# EAGLE design Gadget-Box (EAGLE 6.6.0)

## Sheet 1 of 3
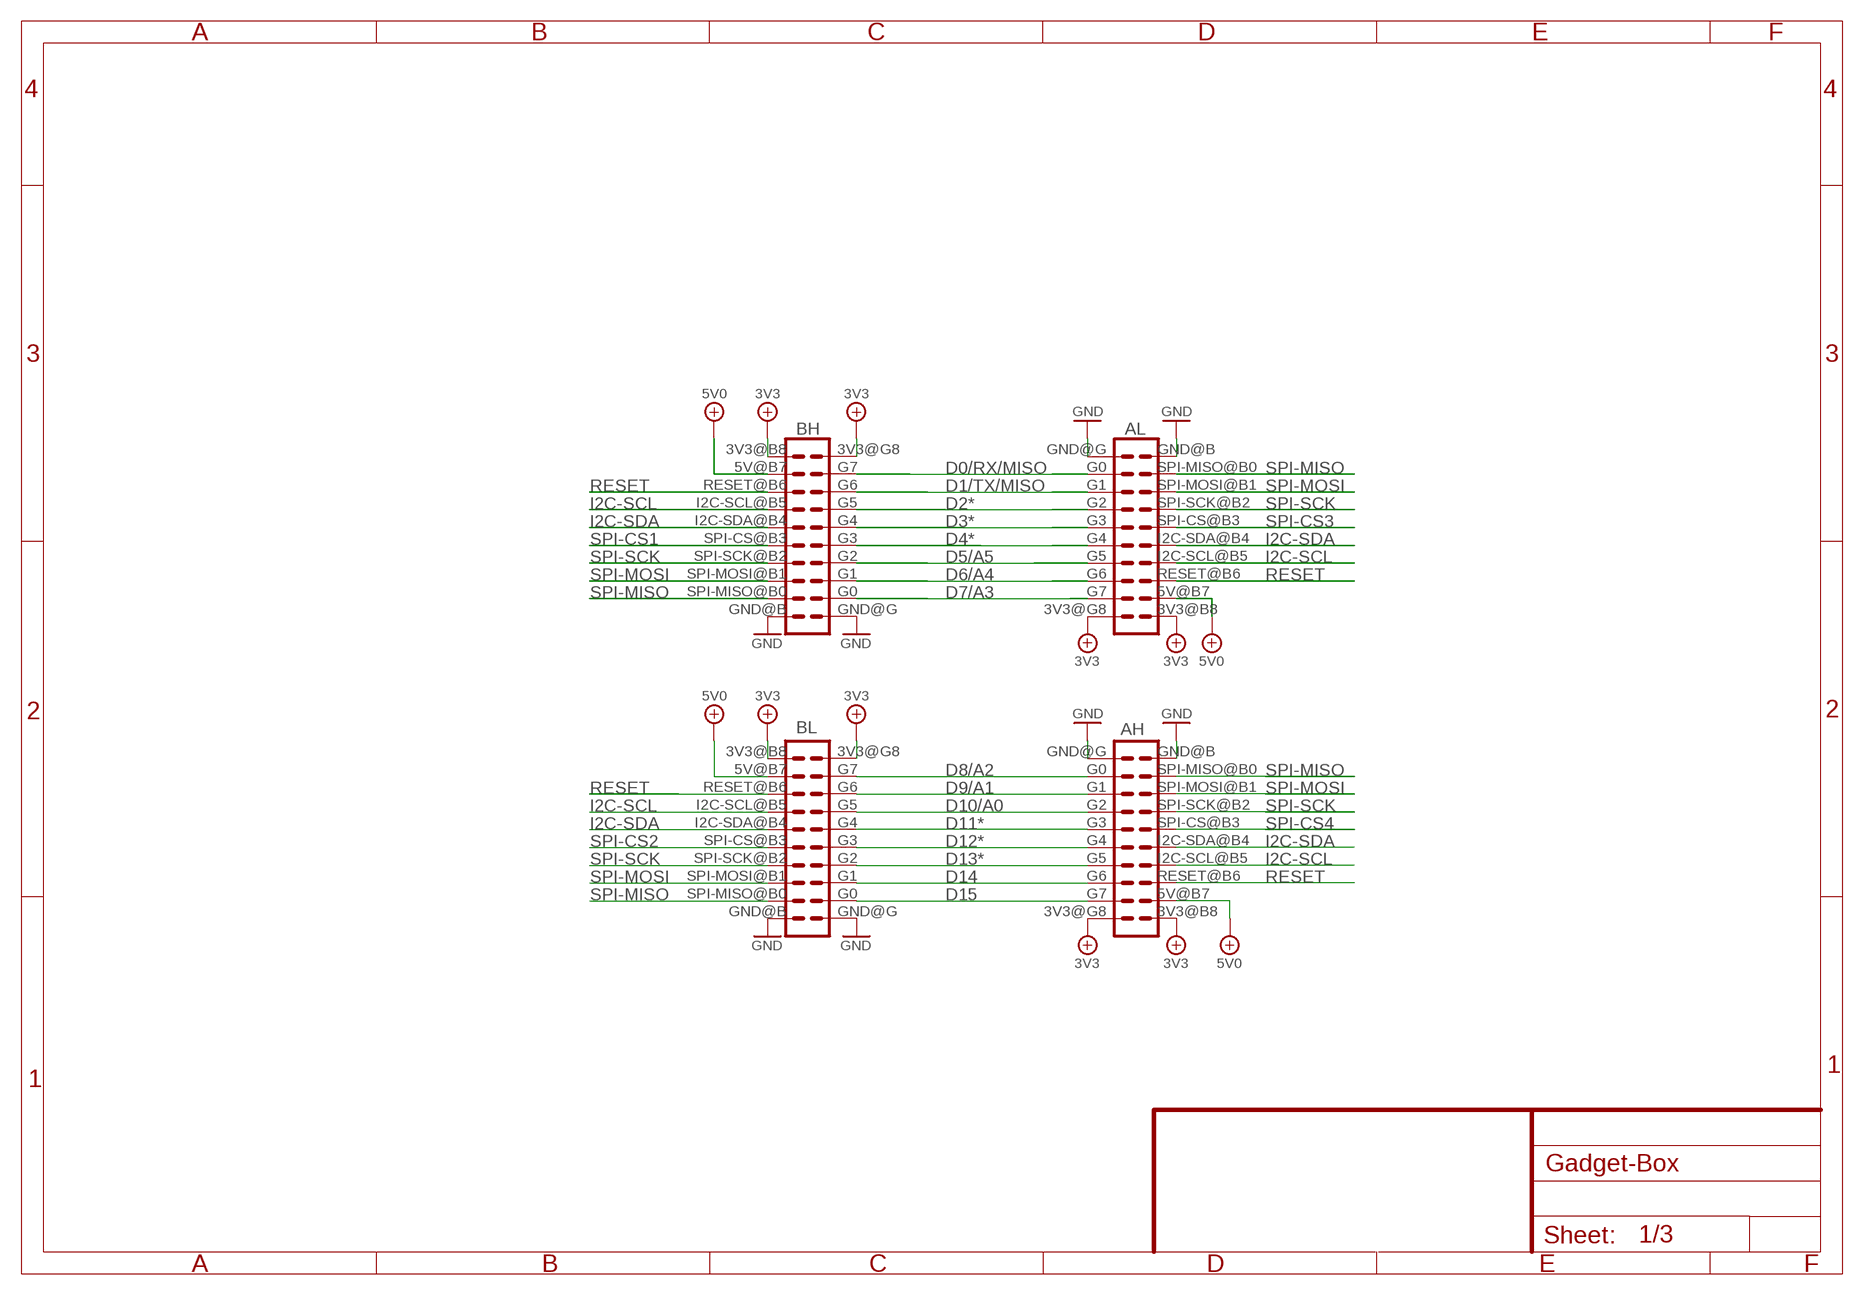
[diagram p0: schematic, sheet 1]

### Parts
AH  ECOGECOG_SLOT  [ECOG]
AL  ECOGECOG_SLOT  [ECOG]
BH  ECOGECOG_SLOT  [ECOG]
BL  ECOGECOG_SLOT  [ECOG]

### Nets
3V3: AH.3V3@B8(3V3) AH.3V3@G8(3V3) AL.3V3@B8(3V3) AL.3V3@G8(3V3) BH.3V3@B8(3V3) BH.3V3@G8(3V3) BL.3V3@B8(3V3) BL.3V3@G8(3V3) ; also sheet 2,3
D0/RX/MISO: AL.G0 BH.G7 ; also sheet 2
D1/TX/MISO: AL.G1 BH.G6 ; also sheet 2
D2*: AL.G2 BH.G5 ; also sheet 2
D3*: AL.G3 BH.G4 ; also sheet 2
D4*: AL.G4 BH.G3 ; also sheet 2
D5/A5: AL.G5 BH.G2 ; also sheet 2,3
D6/A4: AL.G6 BH.G1 ; also sheet 2
D7/A3: AL.G7 BH.G0 ; also sheet 2
D8/A2: AH.G0 BL.G7 ; also sheet 2
D9/A1: AH.G1 BL.G6 ; also sheet 2
D10/A0: AH.G2 BL.G5 ; also sheet 2
D11*: AH.G3 BL.G4 ; also sheet 2
D12*: AH.G4 BL.G3 ; also sheet 2
D13*: AH.G5 BL.G2 ; also sheet 2
D14: AH.G6 BL.G1 ; also sheet 2
D15: AH.G7 BL.G0 ; also sheet 2
GND [gnd]: AH.GND@B(GND) AH.GND@G(GND) AL.GND@B(GND) AL.GND@G(GND) BH.GND@B(GND) BH.GND@G(GND) BL.GND@B(GND) BL.GND@G(GND) ; also sheet 2,3
I2C-SCL: AH.I2C-SCL@B5(I2C-SCL) AL.I2C-SCL@B5(I2C-SCL) BH.I2C-SCL@B5(I2C-SCL) BL.I2C-SCL@B5(I2C-SCL) ; also sheet 2
I2C-SDA: AH.I2C-SDA@B4(I2C-SDA) AL.I2C-SDA@B4(I2C-SDA) BH.I2C-SDA@B4(I2C-SDA) BL.I2C-SDA@B4(I2C-SDA) ; also sheet 2
RESET: AH.RESET@B6(RESET) AL.RESET@B6(RESET) BH.RESET@B6(RESET) BL.RESET@B6(RESET) ; also sheet 2
SPI-CS1: BH.SPI-CS@B3(SPI-CS) ; also sheet 2
SPI-CS2: BL.SPI-CS@B3(SPI-CS) ; also sheet 2
SPI-CS3: AL.SPI-CS@B3(SPI-CS) ; also sheet 2
SPI-CS4: AH.SPI-CS@B3(SPI-CS) ; also sheet 2
SPI-MISO: AH.SPI-MISO@B0(SPI-MISO) AL.SPI-MISO@B0(SPI-MISO) BH.SPI-MISO@B0(SPI-MISO) BL.SPI-MISO@B0(SPI-MISO) ; also sheet 2
SPI-MOSI: AH.SPI-MOSI@B1(SPI-MOSI) AL.SPI-MOSI@B1(SPI-MOSI) BH.SPI-MOSI@B1(SPI-MOSI) BL.SPI-MOSI@B1(SPI-MOSI) ; also sheet 2
SPI-SCK: AH.SPI-SCK@B2(SPI-SCK) AL.SPI-SCK@B2(SPI-SCK) BH.SPI-SCK@B2(SPI-SCK) BL.SPI-SCK@B2(SPI-SCK) ; also sheet 2
VBUS: AH.5V@B7(5V) AL.5V@B7(5V) BH.5V@B7(5V) BL.5V@B7(5V) ; supply symbol labelled 5V0 ; also sheet 2,3

## Sheet 2 of 3
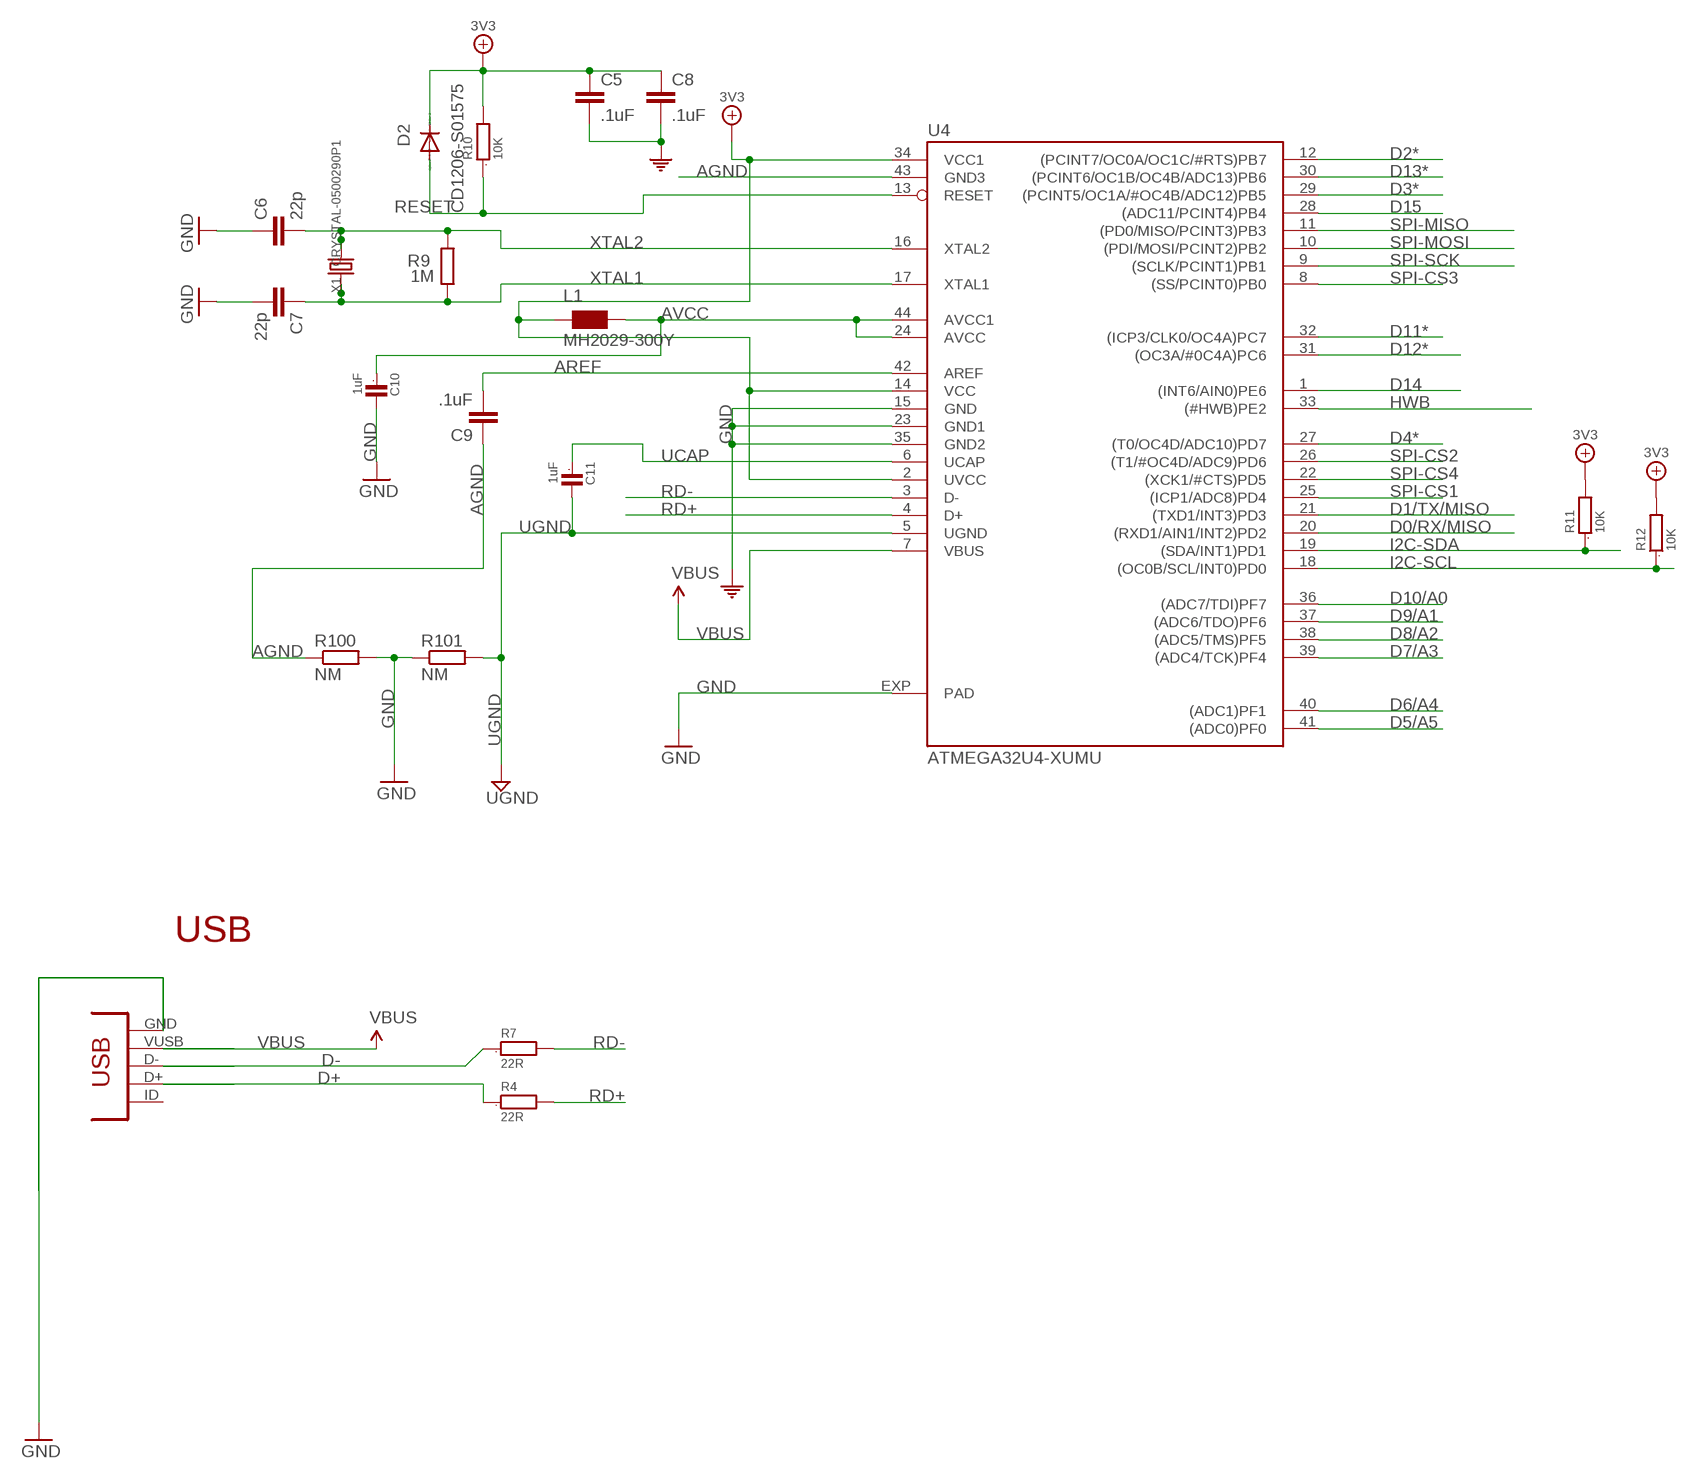
[diagram p1: schematic, sheet 2, part 1 of 2]
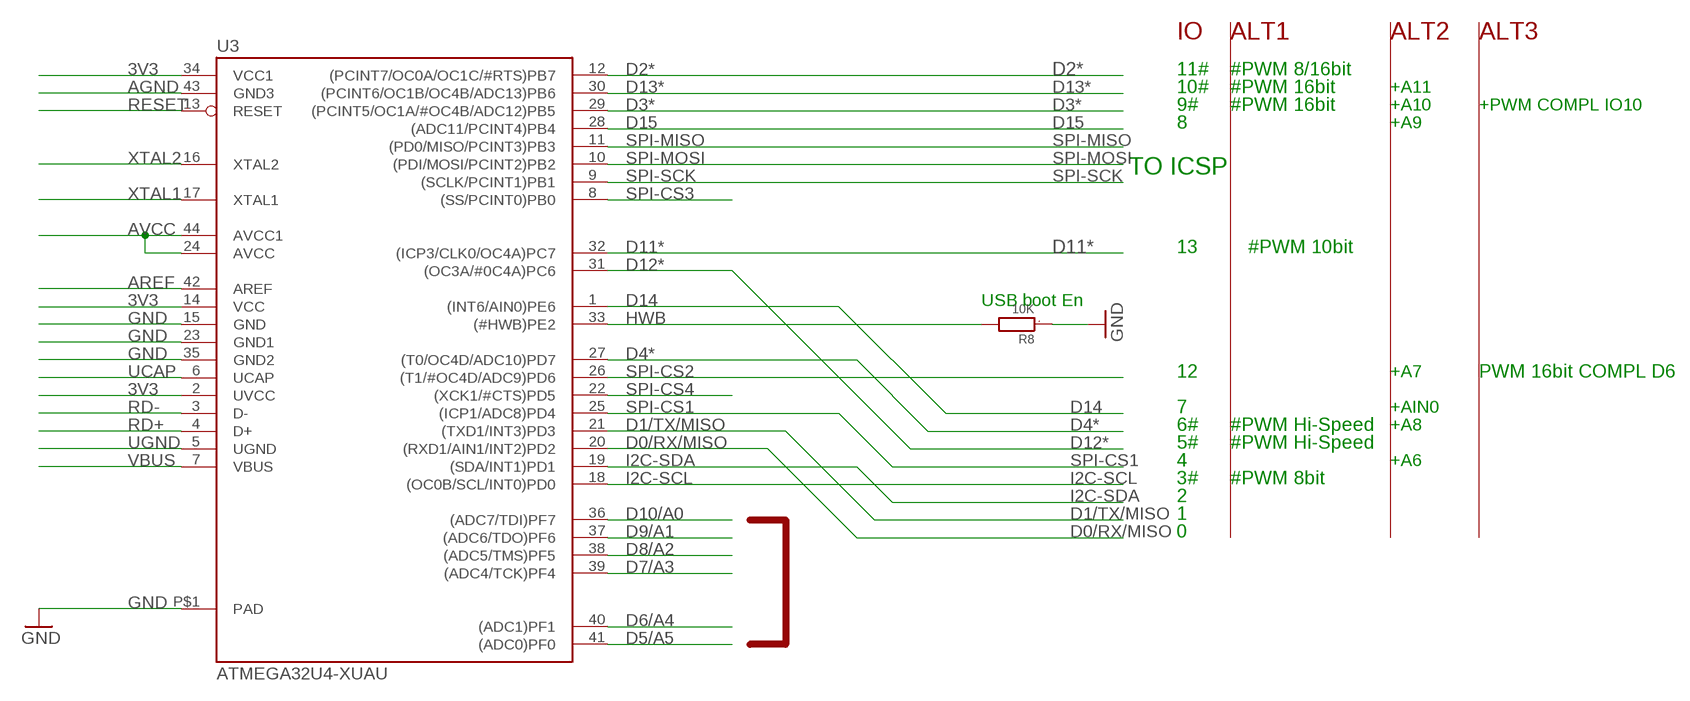
[diagram p2: schematic, sheet 2, part 2 of 2]

### Parts
C5  .1uF  C-EUC0603  [C0603-ROUND]
C6  22p  C-EUC0603  [C0603-ROUND]
C7  22p  C-EUC0603  [C0603-ROUND]
C8  .1uF  C-EUC0603  [C0603-ROUND]
C9  .1uF  C-EUC0603  [C0603-ROUND]
C10  1uF  C0603  [0603]
C11  1uF  C0603  [0603]
D2  CD1206-S01575  DIODE-MINIMELF  [MINIMELF]
L1  MH2029-300Y  WE-CBF_0805  [0805]
R4  22R  R0805  [0805]
R7  22R  R0805  [0805]
R8  10K  R0603  [0603]
R9  1M  R-EU_R0603  [R0603-ROUND]
R10  10K  R0603  [0603]
R11  10K  R0603  [0603]
R12  10K  R0603  [0603]
R100  NM  R-EU_R0603  [R0603-ROUND]
R101  NM  R-EU_R0603  [R0603-ROUND]
U3  ATMEGA32U4-XUAU  [TQFP44-PAD]
U4  ATMEGA32U4-XUMU  [QFN44ML7X7]
USB  CONN_USB  [CONN_USB_MINI-B]
X1  CRYSTAL-0500290P1  [2P-SMD-5.0X3.2]

### Nets
3V3: C5.1 C8.1 D2.C L1.1 R10.2 R11.2 R12.2 U3.2(UVCC) U3.14(VCC) U3.34(VCC1) U4.2(UVCC) U4.14(VCC) U4.34(VCC1) ; also sheet 1,3
AGND: C9.1 R100.1 U3.43(GND3) U4.43(GND3)
AREF [aref]: C9.2 U3.42(AREF) U4.42(AREF)
AVCC: C10.1 L1.2 U3.24(AVCC) U3.44(AVCC1) U4.24(AVCC) U4.44(AVCC1)
D0/RX/MISO: U3.20((RXD1/AIN1/INT2)PD2) U4.20((RXD1/AIN1/INT2)PD2) ; also sheet 1
D1/TX/MISO: U3.21((TXD1/INT3)PD3) U4.21((TXD1/INT3)PD3) ; also sheet 1
D2*: U3.12((PCINT7/OC0A/OC1C/#RTS)PB7) U4.12((PCINT7/OC0A/OC1C/#RTS)PB7) ; also sheet 1
D3*: U3.29((PCINT5/OC1A/#OC4B/ADC12)PB5) U4.29((PCINT5/OC1A/#OC4B/ADC12)PB5) ; also sheet 1
D4*: U3.27((T0/OC4D/ADC10)PD7) U4.27((T0/OC4D/ADC10)PD7) ; also sheet 1
D5/A5: U3.41((ADC0)PF0) U4.41((ADC0)PF0) ; also sheet 1,3
D6/A4: U3.40((ADC1)PF1) U4.40((ADC1)PF1) ; also sheet 1
D7/A3: U3.39((ADC4/TCK)PF4) U4.39((ADC4/TCK)PF4) ; also sheet 1
D8/A2: U3.38((ADC5/TMS)PF5) U4.38((ADC5/TMS)PF5) ; also sheet 1
D9/A1: U3.37((ADC6/TDO)PF6) U4.37((ADC6/TDO)PF6) ; also sheet 1
D10/A0: U3.36((ADC7/TDI)PF7) U4.36((ADC7/TDI)PF7) ; also sheet 1
D11*: U3.32((ICP3/CLK0/OC4A)PC7) U4.32((ICP3/CLK0/OC4A)PC7) ; also sheet 1
D12*: U3.31((OC3A/#0C4A)PC6) U4.31((OC3A/#0C4A)PC6) ; also sheet 1
D13*: U3.30((PCINT6/OC1B/OC4B/ADC13)PB6) U4.30((PCINT6/OC1B/OC4B/ADC13)PB6) ; also sheet 1
D14: U3.1((INT6/AIN0)PE6) U4.1((INT6/AIN0)PE6) ; also sheet 1
D15: U3.28((ADC11/PCINT4)PB4) U4.28((ADC11/PCINT4)PB4) ; also sheet 1
D+: R4.1 USB.D+
D-: R7.1 USB.D-
GND [gnd]: C5.2 C6.1 C7.2 C8.2 C10.2 R8.1 R100.2 R101.1 U3.15(GND) U3.23(GND1) U3.35(GND2) U3.P$1(PAD) U4.15(GND) U4.23(GND1) U4.35(GND2) U4.EXP(PAD) USB.GND ; supply symbol labelled COM ; also sheet 1,3
HWB: R8.2 U3.33((#HWB)PE2) U4.33((#HWB)PE2)
I2C-SCL: R12.1 U3.18((OC0B/SCL/INT0)PD0) U4.18((OC0B/SCL/INT0)PD0) ; also sheet 1
I2C-SDA: R11.1 U3.19((SDA/INT1)PD1) U4.19((SDA/INT1)PD1) ; also sheet 1
RD+: R4.2 U3.4(D+) U4.4(D+)
RD-: R7.2 U3.3(D-) U4.3(D-)
RESET: D2.A R10.1 U3.13(RESET) U4.13(RESET) ; also sheet 1
SPI-CS1: U3.25((ICP1/ADC8)PD4) U4.25((ICP1/ADC8)PD4) ; also sheet 1
SPI-CS2: U3.26((T1/#OC4D/ADC9)PD6) U4.26((T1/#OC4D/ADC9)PD6) ; also sheet 1
SPI-CS3: U3.8((SS/PCINT0)PB0) U4.8((SS/PCINT0)PB0) ; also sheet 1
SPI-CS4: U3.22((XCK1/#CTS)PD5) U4.22((XCK1/#CTS)PD5) ; also sheet 1
SPI-MISO: U3.11((PD0/MISO/PCINT3)PB3) U4.11((PD0/MISO/PCINT3)PB3) ; also sheet 1
SPI-MOSI: U3.10((PDI/MOSI/PCINT2)PB2) U4.10((PDI/MOSI/PCINT2)PB2) ; also sheet 1
SPI-SCK: U3.9((SCLK/PCINT1)PB1) U4.9((SCLK/PCINT1)PB1) ; also sheet 1
UCAP: C11.1 U3.6(UCAP) U4.6(UCAP)
UGND [gnd]: C11.2 R101.2 U3.5(UGND) U4.5(UGND)
VBUS: U3.7(VBUS) U4.7(VBUS) USB.VUSB ; also sheet 1,3
XTAL1: C7.1 R9.1 U3.17(XTAL1) U4.17(XTAL1) X1.1
XTAL2: C6.2 R9.2 U3.16(XTAL2) U4.16(XTAL2) X1.2
Unconnected: USB.BODY@1(BODY) USB.BODY@2(BODY) USB.BODY@3(BODY) USB.BODY@4(BODY) USB.ID(USBID)

### Notes on the sheet
- IO | ALT1 | ALT2 | ALT3
- 11# | #PWM 8/16bit
- 10# | #PWM 16bit | +A11
- 9# | #PWM 16bit | +A10 | +PWM COMPL IO10
- 8 | +A9
- TO ICSP
- 13 | #PWM 10bit
- USB boot En
- 12 | +A7 | PWM 16bit COMPL D6
- 7 | +AIN0
- 6# | #PWM Hi-Speed | +A8
- 5# | #PWM Hi-Speed
- 4 | +A6
- 3# | #PWM 8bit
- 2
- 1
- 0
- USB

## Sheet 3 of 3
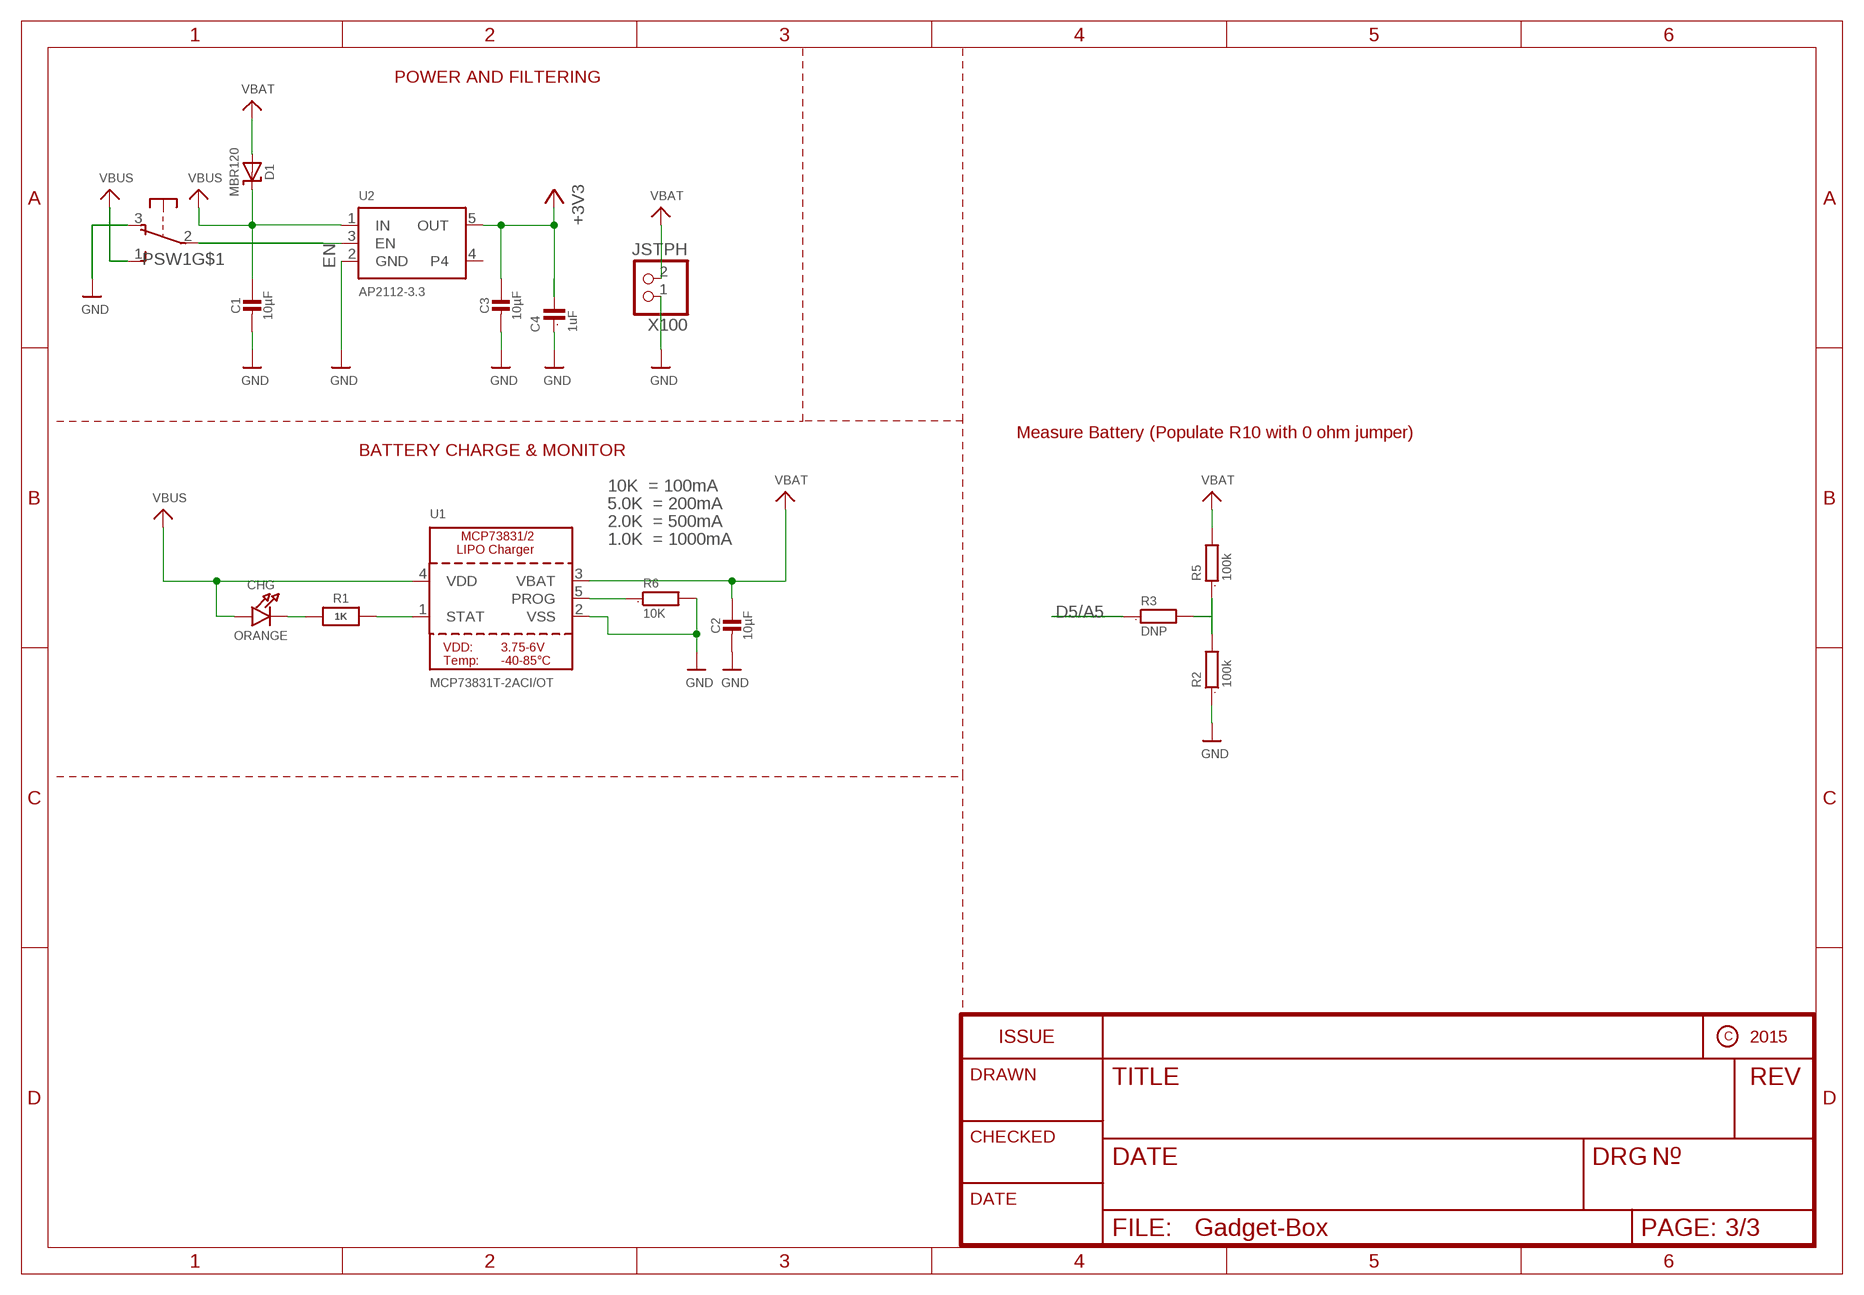
[diagram p3: schematic, sheet 3]

### Parts
C1  10µF  CAP_CERAMIC0805-NOOUTLINE  [0805-NO]
C2  10µF  CAP_CERAMIC0805-NOOUTLINE  [0805-NO]
C3  10µF  CAP_CERAMIC0805-NOOUTLINE  [0805-NO]
C4  1uF  C0603  [0603]
CHG  ORANGE  LED0805_NOOUTLINE  [CHIPLED_0805_NOOUTLINE]
D1  MBR120  DIODE-SCHOTTKYSOD-123  [SOD-123]
PSW1  OS102011MA1Q  [OS102011MA1Q]
R1  1K  RESISTOR_0603_NOOUT  [0603-NO]
R2  100k  R0603  [0603]
R3  DNP  R0603  [0603]
R5  100k  R0603  [0603]
R6  10K  R0603  [0603]
U1  MCP73831T-2ACI/OT  MCP73831/2  [SOT23-5]
U2  AP2112-3.3  VREG_SOT23-5  [SOT23-5]
X100  JSTPH  CON_JST_PH_2PIN  [JSTPH2]

### Nets
3V3: C3.1 C4.2 U2.5(OUT) ; supply symbol labelled +3V3 ; also sheet 1,2
D5/A5: R3.1 ; also sheet 1,2
EN: PSW1.2(P) U2.3(EN)
GND [gnd]: C1.2 C2.2 C3.2 C4.1 PSW1.3(O) R2.1 R6.2 U1.2(VSS) U2.2(GND) X100.1 ; also sheet 1,2
N$1: CHG.C R1.1
N$2: R2.2 R3.2 R5.1
N$3: R1.2 U1.1(STAT)
N$4: R6.1 U1.5(PROG)
VBAT: C2.1 D1.A R5.2 U1.3(VBAT) X100.2
VBUS: C1.1 CHG.A D1.C PSW1.1(S) U1.4(VDD) U2.1(IN) ; also sheet 1,2
Unconnected: PSW1.MT1(MT) PSW1.MT2(MT) U2.4

### Notes on the sheet
- POWER AND FILTERING
- Measure Battery (Populate R10 with 0 ohm jumper)
- BATTERY CHARGE & MONITOR
- 10K  = 100mA
- 5.0K  = 200mA
- 2.0K  = 500mA
- 1.0K  = 1000mA

## Library data of the parts
AH AL BH BL = eCogs:ECOG; PARTNO: PPPC102LFBN-RC,SULLINS CONNECTOR SOLUTIONS,dk,S6106-ND,"CONN HEADER FEM 20POS.1"" DL GOLD", REF67
C1-C3 = microbuilder:CAP_CERAMIC: Ceramic Capacitors For new designs, use the packages preceded by an '_' character since they are more reliable: The following footprints should be used on most boards: _0402 - Standard footprint for regular board layouts _0603 - Standard footprint for regular board layouts _0805 - Standard footprint for regular board layouts _1206 - Standard footprint for regular board layouts For extremely tight-pitch boards where space is at a premium, the following 'micro-pitch' footprints can be used (smaller pads, no silkscreen outline, etc.): _0402MP - Micro-pitch footprint for very dense/compact boards _0603MP - Micro-pitch footprint for very dense/compact boards _0805MP - Micro-pitch footprint for very dense/compact boards _1206MP - Micro-pitch footprint for very dense/compact boards; PARTNO: CL21F106ZPFNNNE,Samsung,DK,1276-3012-1-ND,CAP CER 10UF 10V Y5V 0805, REF1
C4 C10 C11 = GadgetFactory:C: CAPACITOR, European symbol; PARTNO: C1608X5R1A105K080AC,TDK CORPORATION (VA),dk,445-1321-1-ND,CAP CER 1UF 10V X5R 0603, REF53
C5 C8 C9 = SmartPrj:C-EU: CAPACITOR, European symbol; PARTNO: GRM188F51E104ZA01D,MURATA ELECTRONICS (VA),DK,490-1575-1-ND,CAP CER .1UF 25V Y5V 0603, REF2
C6 C7 = SmartPrj:C-EU: CAPACITOR, European symbol; PARTNO: C1608C0G1H220J080AA,TDK CORPORATION (VA),dk,445-1273-1-ND,CAP CER 22PF 50V C0G 0603, REF58
CHG = microbuilder:LED: LED 0603 - 0603 Surface Mount Package 2mA: Green LED - Low Power (3.9mcd, 2ma, 1.7Vf) - Digikey: 475-2709-2-ND Orange LED - Low Power (9.8mcd, 2ma, 1.8Vf) - Digikey: 475-1194-2-ND Red LED - Low Power (5mcd, 2ma, 1.8Vf) - Digikey: 475-1195-2-ND Yellow LED - Low Power (7mcd, 2ma, 1.8Vf) - Digikey: 475-1196-2-ND 5mA: Blue LED - Low Power (17mcd, 5ma, 2.9Vf) - Digikey: LNJ937W8CRACT-ND 0805 - 0805 Surface Mount Package 2mA: Red LED (8.8mcd, 2mA, 1.8Vf, Clear) - Low Power [Digikey: 475-2510-1-ND] Green LED (5mcd, 2mA, 1.8Vf, Clear) - Low Power [Digikey: 475-2730-1-ND] Yellow LED (11.3mcd, 2mA, 1.8Vf, Clear) - Low Power [Digikey: 475-2555-1-ND] 20mA: Red LED (104mcd, 20mA, Diffused) - LS R976 [Digikey: 475-1278-6-ND] Red LED (12mcd, 20mA, 2.0Vf, Clear) - APT2012EC [Digikey: 754-1128-1-ND] Green LED (15mcd, 20mA, 2.2Vf, Clear) - APT2012GC [Digikey: 754-1131-1-ND] Orange LED (160mcd, 20mA, 2.1Vf, Clear) - APT2012SECK [Digikey: 754-1130-1-ND] 1206 - 1206 Surface Mount Package Green LED (26mcd, 20mA, Diffused) - LG N971 [Digikey: 475-1407-6-ND] Red LED (15mcd, 20mA, Diffused) - LH N974 [Digikey: 475-1416-6-ND] Cree - Cree High-Power Surface Mount LEDs XPEBWT-L1-0000-00D50 - White 111lm 350mA 2.9Vf 6200K 110° XTEAWT-00-0000-00000LEE3 - White 114lm 350mA 2.85Vf 5000K 115° Everlight - Everlight 45-21 Series Surface Mount LEDs 45-21/QK2C-B2832AC2CB2/2T - Warm White 2000mcd 20mA 3.25Vf 3050K 120° 45-21/LK2C-B38452C4CB2/2T - Nuetral White 2000mcd 20mA 3.25Vf 4150K 120° 45-21/LK2C-B50634C6CB2/2T - Cold White 2200mcd 20mA 3.25Vf 5650K 120° PLCC2 Reverse Mount LS T77K-J1L2-1-0-2-R18-Z - Red 11.25mcd 2mA 1.8Vf 630nm 120° LO T77K-L1M2-24-Z - Orange 19.6mcd 2mA 1.8Vf 606nm 120° LY T77K-K2M1-26-Z - Yellow 15.7mcd 2mA 1.8Vf 587nm 120°; PARTNO: LTST-C171EKT,LITE-ON INC (VA),DK,160-1422-1-ND,LED RED ORAN CLEAR THIN 0805 SMD, REF6
D1 = microbuilder:DIODE-SCHOTTKY; PARTNO: MBR120VLSFT3G,on semiconductor,dk,MBR120VLSFT3GOSCT-ND ,DIODE SCHOTTKY 20V 1A SOD123FL , REF71
D2 = diode:DIODE-: DIODE; PARTNO: CD1206-S01575,BOURNS INC (VA),dk,CD1206-S01575CT-ND,DIODE GEN PURP 100V 150MA 1206, REF46
L1 = wuerth-elektronik:WE-CBF: SMD EMI Suppression Ferrite Beads - excellent anti-EMI properties - low DCR - impedances till 3000 ohms - rated current up to 6 A; PARTNO: MH2029-300Y,BOURNS INC (VA),dk,MH2029-300YCT-ND,FERRITE BEAD 30 OHM 0805 1LN, REF60
PSW1 = adafruit:OS102011MA1Q: OS10201MA1Q through-hole right angle switch http://www.ladyada.net/library/eagle; PARTNO: OS102011MA1QN1,C&K Components,dk,CKN9559-ND,SWITCH SLIDE SPDT 100MA 12V , REF72
R1 = microbuilder:RESISTOR: Resistors For new designs, use the packages preceded by an '_' character since they are more reliable: The following footprints should be used on most boards: _0402 - Standard footprint for regular board layouts _0603 - Standard footprint for regular board layouts _0805 - Standard footprint for regular board layouts _1206 - Standard footprint for regular board layouts For extremely tight-pitch boards where space is at a premium, the following 'micro-pitch' footprints can be used (smaller pads, no silkscreen outline, etc.): _0402MP - Micro-pitch footprint for very dense/compact boards _0603MP - Micro-pitch footprint for very dense/compact boards _0805MP - Micro-pitch footprint for very dense/compact boards _1206MP - Micro-pitch footprint for very dense/compact boards; PARTNO: RC0603JR-071KL,YAGEO (VA),dk,311-1.0KGRTR-ND,RES SMD 1K OHM 5% 1/10W 0603 , REF73
R2 R5 = GadgetFactory:R: RESISTOR, European symbol; PARTNO: RC0603JR-07100KL,YAGEO (VA),dk,311-100KGRCT-ND,RES SMD 100K OHM 5% 1/10W 0603 , REF76
R3 = GadgetFactory:R: RESISTOR, European symbol; BOM: EXCLUDE
R4 R7 = GadgetFactory_6.0:R: RESISTOR, European symbol; PARTNO: RMCF0805JT22R0,STACKPOLE ELECTRONICS INC (VA),dk,RMCF0805JT22R0CT-ND,RES SMD 22 OHM 5% 1/8W 0805, REF62
R6 R11 R12 = GadgetFactory:R: RESISTOR, European symbol; PARTNO: RC0603JR-0710KL,YAGEO (VA),dk,311-10KGRCT-ND,RES SMD 10K OHM 5% 1/10W 0603 , REF36
R8 R10 = GadgetFactory_6.0:R: RESISTOR, European symbol; PARTNO: RC0603JR-0710KL,YAGEO (VA),dk,311-10KGRCT-ND,RES SMD 10K OHM 5% 1/10W 0603 , REF36
R9 = SmartPrj:R-EU_: RESISTOR, European symbol; PARTNO: RMCF0603JT1M00,STACKPOLE ELECTRONICS INC (VA),dk,RMCF0603JT1M00CT-ND,RES SMD 1M OHM 5% 1/10W 0603, REF57
R100 R101 = SmartPrj:R-EU_: RESISTOR, European symbol; BOM: EXCLUDE
U1 = microbuilder:MCP73831/2: MCP73831/2 LIPO Charger VDD: 3.75 - 6V Temp -40 - 85°C Programmable Charge Rate: 15-500mA NOTE: STAT is a tri-state logic output on the MCP73831 and an open-drain output on the MCP73832. SOT23-5 with 4.2V output and tri-state logic on STAT = MCP73831T-2ACI/OT; PARTNO: MCP73831T-2ACI/OT,MICROCHIP TECHNOLOGY (VA),dk,MCP73831T-2ACI/OTCT-ND,IC CONTROLLR LI-ION 4.2V SOT23-5, REF74
U2 = microbuilder:VREG_SOT23-5: SOT23-5 Fixed Voltage Regulators Part Current Out V Out V In V Dropout θJA (°C/W) TJ (°C) Digikey Part No. ADP121 150mA 3.3V 3.4-5.5V 0.09V @ 150mA -- -- ADP121-AUJZ33R7CT-ND ADP121 150mA 3.0V 3.1-5.5V 0.09V @ 150mA -- -- ADP121-AUJZ30R7CT-ND ADP122 300mA 3.3V 3.4-5.5V 0.085V @ 300mA -- -- ADP122AUJZ-3.3-R7CT-ND ADP1712 300mA 3.3V 3.5-5.5V 0.17V @ 300mA -- -- ADP1712AUJZ-3.3-R7TR-ND AP7311 (Low Cost) 150mA 3.3V 3.5-6V 0.15V @ 150mA -- -- AP7311-33WG-7DICT-ND LD39015M18R 150mA 1.8V 1.9V-5.5V 0.08V @ 100mA -- -- 497-6977-1-ND LP2985A-33DBVR 150mA 3.3V 3.3-16V 0.28V @ 150mA 206 150 296-18479-1-ND MCP1824T-3302E/OT 300mA 3.3V 3.5V-6V 0.2V @ 300mA -- -- MCP1824T-3302E/OTCT-ND MIC5205-2.5YM5 TR 150mA 2.5V 2.7-16V 0.165V @ 150mA -- -- 576-1257-2-ND MIC5205-3.0YM5 TR 150mA 3.0V 3.2V-16V 0.165V @ 150mA -- -- 576-1258-2-ND MIC5205-3.3YM5 TR 150mA 3.3V 3.5V-16V 0.165V @ 150mA -- -- 576-1259-2-ND TPS780330220 150mA 3.3V+2.2V 3.6-5.5V 250mV Max -- -- 296-23332-1-ND TDA3663/N1,135 100mA 3.3V 3.5-45V 0.18V @ 50mA -- -- 568-5343-1-ND Max operating temp can be calculated using θJA, TJ (max junction temperature), and power in watts. Set the "Maximum Ambient Temperature" until it reaches TJ ("Max Junction Temperature"), which is the absolute limit for safe use of the regulator: Heat Sink Temperature Calculator <http://www.daycounter.com/Calculators/Heat-Sink-Temperature-Calculator.phtml> For example, With 12V source into a 3.3V LP2985 and a 30mA load, we are dissipating (12V-3.3V) * 0.03A = 0.261W. With a θJA of 206 °C/W, a TJ of 150°C, and 261mW we can safely use the chip without a heat sink up to 75°C (=147.1°C Junction Temperature).; PARTNO: AP2112K-3.3TRG1,Diodes Incorporated,dk,AP2112K-3.3TRG1DICT-ND,IC REG LDO 3.3V 0.6A SOT25 , REF75
U3 = SmartPrj:ATMEGA32U4-XU; PARTNO: ATMEGA32U4-AUR,ATMEL (VA),dk,ATMEGA32U4-AURCT-ND,IC MCU 8BIT 32KB FLASH 44TQFP, REF48
U4 = SmartPrj:ATMEGA32U4-XU; BOM: EXCLUDE
USB = dp_devices:CONN_USB: USB connector; PARTNO: USB-M26FTR,ON SHORE TECHNOLOGY INC (VA),dk,ED2992CT-ND,CONN USB MINI B R/A SMD, REF66
X1 = OPL Eagle Library:CRYSTAL*; PARTNO: ABM3-8.000MHZ-D2Y-T,Abracon Corporation,dk,535-10630-1-ND ,CRYSTAL 8.0000MHZ 18PF SMD , REF70
X100 = microbuilder:CON_JST_PH_2PIN: JST 2-Pin Right-Angle Connector PH-Series - 4UConnector: 17311 SH-Series - 4UConnector: 07278; PARTNO: S2B-PH-SM4-TB(LF)(SN),JST SALES AMERICA INC (VA),dk,455-1749-1-ND,CONN HEADER PH SIDE 2POS 2MM SMD, REF69

## Net classes
2 gnd: width 0.254 mm, drill 0.381 mm, clearance 0.254 mm
3 usbvcc: width 0.254 mm, drill 0.381 mm, clearance 0.254 mm
4 aref: width 0.254 mm, drill 0.381 mm, clearance 0.254 mm

## Board
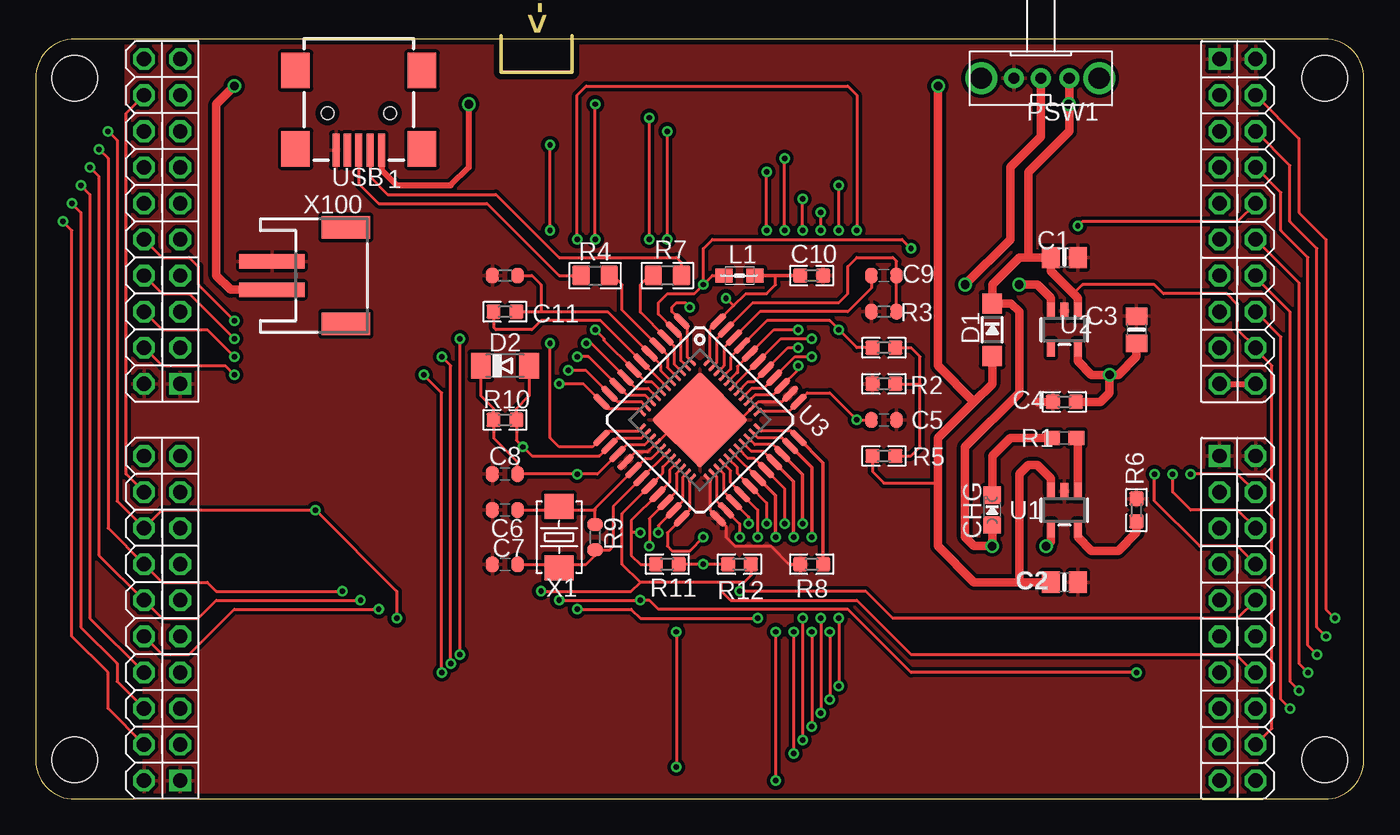
[diagram p4: board, top side]
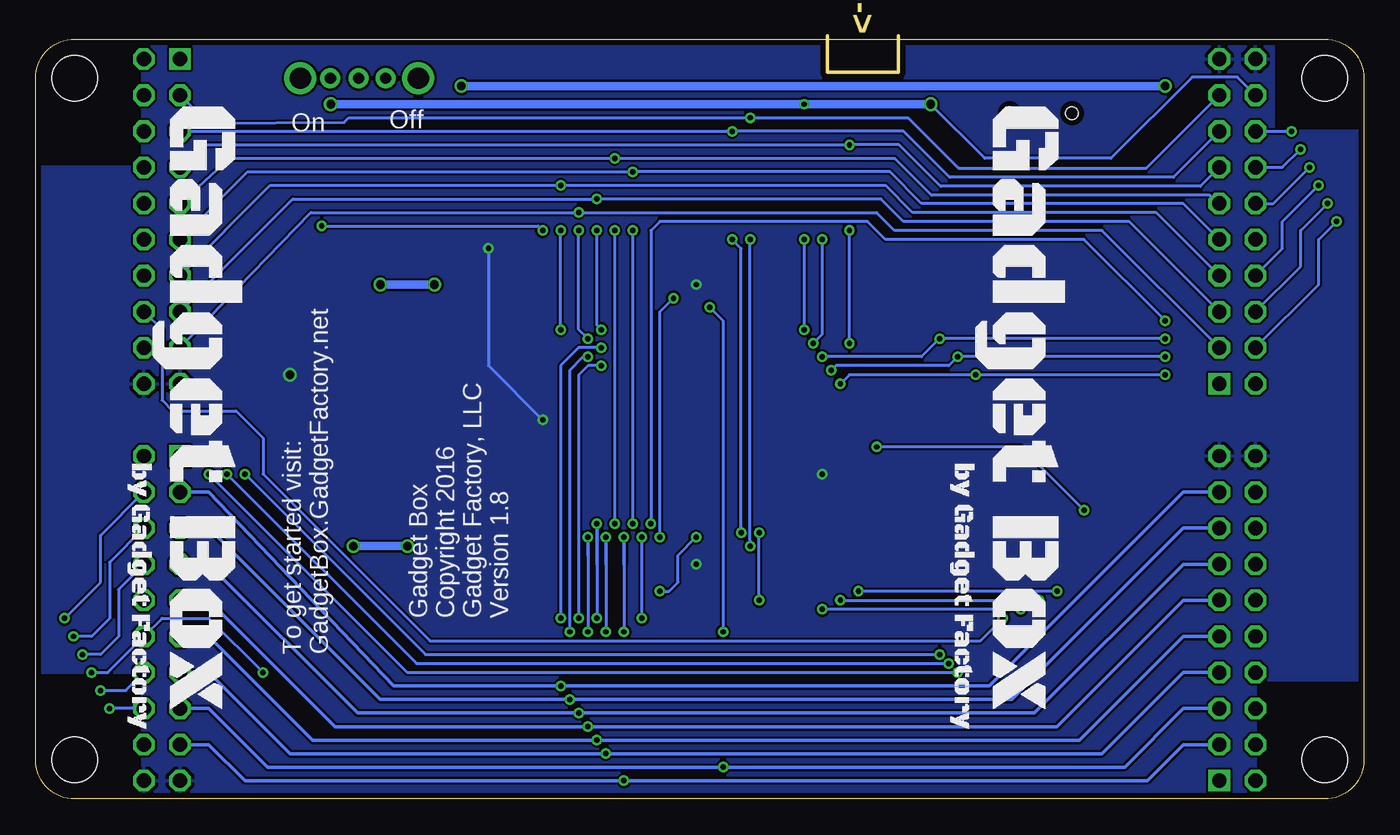
[diagram p5: board, bottom side, seen from below]

Size 93.5 x 53.75 mm. Coordinates in mm from the lower left corner, seen from the top.
Outline: 37.75,53.75 37.75,51.15 32.75,51.15 32.75,53.75
Copper layers (1*16): Top 0.0356mm / dielectric 1.5011mm / Bottom 0.0356mm
Design rules "OSHpark-Design-Rules": minimum track width 6mil, minimum drill 13mil, track to track 6mil, track to pad 6mil, pad to pad 6mil, via to via 6mil, smd to smd 6mil, copper to edge 15mil, drill to drill 6mil, minimum pad ring 7mil, minimum via ring 7mil, stop-mask expansion 3mil, vias tented up to drill 0mil, thermal gap 10mil

### Footprints (pad centres in the part's own frame; a part is rotated, then mirrored left to right if it is on the bottom)
ECOG93P53P5 = hole 3.2: 4,4; 92,4; 92,52; 4,52
ECOG = drill 1.016 octagon: 3V3@B8 21.59,3.81; 3V3@G8 21.59,1.27; 5V@B7 19.05,3.81; G0 1.27,1.27; G1 3.81,1.27; G2 6.35,1.27; G3 8.89,1.27; G4 11.43,1.27; G5 13.97,1.27; G6 16.51,1.27; G7 19.05,1.27; GND@B -1.27,3.81; I2C-SCL@B5 13.97,3.81; I2C-SDA@B4 11.43,3.81; RESET@B6 16.51,3.81; SPI-CS@B3 8.89,3.81; SPI-MISO@B0 1.27,3.81; SPI-MOSI@B1 3.81,3.81; SPI-SCK@B2 6.35,3.81 | drill 1.016 square: GND@G -1.27,1.27
0805-NO = smd 1.24 x 1.5: 1 -0.95,0; 2 0.95,0
0603 = smd 1 x 1: 1 -0.8,0; 2 0.8,0
C0603-ROUND = smd 0.898 x 1.1: 1 -0.889,0; 2 0.889,0
CHIPLED_0805_NOOUTLINE = smd 1.2 x 1.2: A 0,-1.05; C 0,1.05
SOD-123 = smd 1.4 x 1.4: A 1.85,0; C -1.85,0
MINIMELF = smd 1.4 x 1.8: A 1.7,0; C -1.7,0
0805 = smd 1.2 x 1: 1 -1.1,0; 2 1.1,0
OS102011MA1Q = drill 0.8 pad 1.422: 1 -2,0; 2 0,0; 3 1.9,0 | drill 1.5 pad 2.184: MT1 -4.1,0; MT2 4.2,0
0603-NO = smd 1.1 x 1: 1 -0.85,0; 2 0.85,0
0805' = smd 1.2 x 1.4: 1 -1,0; 2 1,0
R0603-ROUND = smd 0.898 x 1.1: 1 -0.889,0; 2 0.889,0
SOT23-5 = smd 0.55 x 1.2: 1 -0.95,-1.3; 2 0,-1.3; 3 0.95,-1.3; 4 0.95,1.3; 5 -0.95,1.3
TQFP44-PAD = smd 1.4 x 0.45: 1 -5.8,4; 2 -5.8,3.2; 3 -5.8,2.4; 4 -5.8,1.6; 5 -5.8,0.8; 6 -5.8,0; 7 -5.8,-0.8; 8 -5.8,-1.6; 9 -5.8,-2.4; 10 -5.8,-3.2; 11 -5.8,-4; 23 5.8,-4; 24 5.8,-3.2; 25 5.8,-2.4; 26 5.8,-1.6; 27 5.8,-0.8; 28 5.8,0; 29 5.8,0.8; 30 5.8,1.6; 31 5.8,2.4; 32 5.8,3.2; 33 5.8,4 | smd 0.45 x 1.4: 12 -4,-5.8; 13 -3.2,-5.8; 14 -2.4,-5.8; 15 -1.6,-5.8; 16 -0.8,-5.8; 17 0,-5.8; 18 0.8,-5.8; 19 1.6,-5.8; 20 2.4,-5.8; 21 3.2,-5.8; 22 4,-5.8; 34 4,5.8; 35 3.2,5.8; 36 2.4,5.8; 37 1.6,5.8; 38 0.8,5.8; 39 0,5.8; 40 -0.8,5.8; 41 -1.6,5.8; 42 -2.4,5.8; 43 -3.2,5.8; 44 -4,5.8 | smd 1 x 1: P$1 0,0
QFN44ML7X7 = smd 0.75 x 0.275: 1 -3.275,2.5; 2 -3.275,2; 3 -3.275,1.5; 4 -3.275,1; 5 -3.275,0.5; 6 -3.275,0; 7 -3.275,-0.5; 8 -3.275,-1; 9 -3.275,-1.5; 10 -3.275,-2; 11 -3.275,-2.5; 23 3.275,-2.5; 24 3.275,-2; 25 3.275,-1.5; 26 3.275,-1; 27 3.275,-0.5; 28 3.275,0; 29 3.275,0.5; 30 3.275,1; 31 3.275,1.5; 32 3.275,2; 33 3.275,2.5 | smd 0.275 x 0.75: 12 -2.5,-3.275; 13 -2,-3.275; 14 -1.5,-3.275; 15 -1,-3.275; 16 -0.5,-3.275; 17 0,-3.275; 18 0.5,-3.275; 19 1,-3.275; 20 1.5,-3.275; 21 2,-3.275; 22 2.5,-3.275; 34 2.5,3.275; 35 2,3.275; 36 1.5,3.275; 37 1,3.275; 38 0.5,3.275; 39 0,3.275; 40 -0.5,3.275; 41 -1,3.275; 42 -1.5,3.275; 43 -2,3.275; 44 -2.5,3.275 | smd 4.826 x 4.826: EXP 0,0
CONN_USB_MINI-B = smd 2 x 2.5: BODY@1 -4.45,2.5; BODY@2 4.45,2.5; BODY@3 4.45,-3; BODY@4 -4.45,-3 | smd 0.5 x 2.3: D+ 0,2.6; D- -0.8,2.6; GND 1.6,2.6; ID 0.8,2.6; VUSB -1.6,2.6 | hole 0.9: -2.2,0; 2.2,0
2P-SMD-5.0X3.2 = smd 1.778 x 2.032: 1 -2.159,0; 2 2.159,0
JSTPH2 = smd 1 x 4.6: 1 -1,-3.7; 2 1,-3.7 | smd 1.6 x 3.4: NC1 -3.4,1.5; NC2 3.4,1.5

### Placement (x,y rotation side)
$$U$1  [ECOG93P53P5]  -1.25,-1.25 0 top
AH  82.06,22.88 270 top
AL  82.06,50.82 270 top
BH  11.45,30.5 90 top
BL  11.45,2.56 90 top
C1  72.41,38.12 0 top
C2  72.41,15.26 0 top
C3  77.49,33.04 90 top
C4  72.41,27.96 0 top
C5  59.71,26.69 0 top
C6  33.04,20.34 0 top
C7  33.04,16.53 180 top
C8  33.04,22.88 180 top
C9  59.71,36.85 180 top
C10  54.63,36.85 0 top
C11  33.04,34.31 0 top
CHG  67.33,20.34 0 top
D1  67.33,33.04 270 top
D2  33.04,30.5 0 top
L1  49.55,36.85 0 top
PSW1  70.76,50.74 180 top
R1  72.41,25.42 0 top
R2  59.71,29.23 0 top
R3  59.71,31.77 0 top
R4  22R  [0805']  39.39,36.85 0 top
R5  59.71,24.15 180 top
R6  77.49,20.34 90 top
R7  22R  [0805']  44.47,36.85 180 top
R8  54.63,16.53 0 top
R9  39.39,18.43 90 top
R10  33.04,26.69 180 top
R11  44.47,16.53 0 top
R12  49.55,16.53 180 top
R100  59.71,34.31 180 top
R101  33.04,36.85 0 top
U1  72.41,20.34 180 top
U2  72.41,33.04 180 top
U3  46.76,26.69 315 top
U4  46.76,26.69 315 top
U$100  [GADGETBOX_TEXT]  24.4,27.45 270 bottom
U$101  [GADGETBOX_TEXT]  82.32,27.45 270 bottom
USB  22.75,48.28 180 top
X1  36.85,18.43 90 top
X100  20.34,36.85 270 top

### Tracks (layer width: path | path; a pad name or v marks a point on that pad's centre or on a via)
3V3  (via drill 0.38, 0.6)
  Top 0.203: U4.14 42.89,24.94 41.62,24.94 U3.14 39.55,22.88 v38.12,22.88 C8.1 33.93,23.73 32.24,25.42 R10.2 32.24,27.49 31.34,28.39 D2.C | v47.01,36.22 46.38,35.58 44.47,35.58 43.84,34.95 43.84,34.14 U3.2 45.42,32.55 45.42,30.85 U4.2 | L1.1 47.65,36.85 v47.01,36.22 | R12.2 v47.01,16.53 R11.2 | U4.34 50.93,27.32 53.05,27.32 U3.34 54.32,28.59 55.9,28.59 v57.8,26.69 C5.1 | v47.01,36.22 47.01,38.76 47.65,39.39 60.98,39.39 v61.62,38.76
  Top 0.406: AL.3V3@G8 AL.3V3@B8
  Top 0.61: C3.1 77.49,31.13 76.22,29.86 v75.58,29.86 | U2.5 73.36,30.82 74.31,29.86 v75.58,29.86 | C4.2 74.95,27.96 75.58,28.59 v75.58,29.86
  Bottom 0.203: v61.62,38.76 61.62,30.5 v57.8,26.69
  pour Bottom: -1.25,8.4 -1.25,47.01 6.37,47.01 6.37,55.77 85.95,55.77 85.95,44.47 95.56,44.47 95.56,8.91 85.95,8.91 85.95,-1.76 7.64,-1.76 7.64,8.4
AGND
  Top 0.203: U4.43 47.96,30.73 47.96,32.42 U3.43 50.49,34.95 56.53,34.95 57.17,35.58 57.17,37.48 57.8,38.12 60.34,38.12 60.6,37.87 C9.1 R100.1
AREF
  Top 0.203: U4.42 48.44,30.49 48.44,31.77 U3.42 50.98,34.31 57.17,34.31 58.82,35.96 C9.2
AVCC  (via drill 0.38)
  Top 0.203: U4.24 47.96,22.66 47.96,20.96 U3.24 49.55,19.37 v49.55,18.43 | U4.44 47.49,30.96 47.49,33.08 U3.44 49.13,34.73 | 49.13,34.73 49.99,35.58 51.45,35.58 52.09,36.22 52.09,36.85 | v48.6,35.26 49.13,34.73
  Top 0.254: C10.1 52.09,36.85 L1.2
  Bottom 0.203: v49.55,18.43 49.55,34.31 v48.6,35.26
D0/RX/MISO  (via drill 0.38)
  Top 0.203: U4.20 45.1,22.92 45.1,21.64 U3.20 43.2,19.74 v43.2,17.8 | v43.2,39.39 v43.2,47.96
  Bottom 0.203: v43.2,17.8 v43.2,39.39 | AL.G0 81.37,47.59 71.78,47.65 71.46,47.96 v43.2,47.96 32.09,47.96 28.54,44.41 15.32,44.41 BH.G7
D1/TX/MISO  (via drill 0.38)
  Top 0.203: U4.21 45.58,22.69 45.58,20.99 U3.21 43.84,19.24 v43.84,18.75 | v44.47,39.39 v44.47,47.01
  Bottom 0.203: v43.84,18.75 43.84,38.76 v44.47,39.39 | BH.G6 13.41,43.78 29.17,43.78 32.41,47.01 v44.47,47.01 AL.G1
D2*  (via drill 0.38)
  Top 0.203: U4.12 42.43,25.9 40.3,25.9 U3.12 39.19,24.79 36.85,24.79 36.22,25.42 v36.22,32.09 | v36.22,40.02 v36.22,46.06
  Bottom 0.203: BH.G5 11.51,43.14 29.81,43.14 32.72,46.06 v36.22,46.06 81.75,46.06 AL.G2 | v36.22,32.09 v36.22,40.02
D3*  (via drill 0.38)
  Top 0.203: U4.29 50.16,23.99 50.59,23.99 U3.29 52.73,21.85 v52.73,19.39 | v52.73,40.02 v52.73,45.1
  Bottom 0.203: v52.73,19.39 v52.73,40.02 | BH.G4 10.88,42.5 30.44,42.5 33.04,45.1 v52.73,45.1 79.84,45.1 AL.G3
D4*  (via drill 0.38)
  Top 0.203: U4.27 49.39,23.35 49.39,22.92 U3.27 51.45,20.86 v51.45,19.39 | v51.45,40.02 v51.45,44.15
  Bottom 0.203: v51.45,19.39 v51.45,40.02 | BH.G3 12.72,41.93 31.13,41.93 33.36,44.15 v51.45,44.15 78.57,44.15 AL.G4
D5/A5  (via drill 0.38)
  Top 0.203: U4.41 48.91,30.26 48.91,31.11 U3.41 51.48,33.67 55.9,33.67 v56.53,33.04 57.8,31.77 R3.1 | v56.53,40.02 v56.53,43.2
  Bottom 0.203: BH.G2 14.62,41.3 31.77,41.3 33.67,43.2 v56.53,43.2 76.98,43.2 AL.G5 | v56.53,33.04 v56.53,40.02
D6/A4  (via drill 0.38)
  Top 0.203: 49.39,30.02 49.39,30.46 U3.40 51.98,33.04 v53.68,33.04 | U4.40 49.38,30.02 | v53.99,40.02 v53.99,42.25
  Top 0.254: 49.38,30.02 49.39,30.02
  Bottom 0.203: BH.G1 16.53,40.66 32.41,40.66 33.99,42.25 v53.99,42.25 75.39,42.25 AL.G6 | v53.68,33.04 53.99,33.36 v53.99,40.02
D7/A3  (via drill 0.38)
  Top 0.203: U4.39 U3.39 52.47,32.41 v54.63,32.41 | v55.27,40.02 v55.27,41.3
  Bottom 0.203: BH.G0 18.43,40.02 33.04,40.02 34.31,41.3 v55.27,41.3 74.12,41.3 AL.G7 | v54.63,32.41 55.27,33.04 v55.27,40.02
D8/A2  (via drill 0.38)
  Top 0.203: U4.38 50.16,29.39 50.59,29.39 U3.38 52.97,31.77 v53.68,31.77 | v56.53,12.72 v56.53,7.96
  Bottom 0.203: v53.68,31.77 55.27,31.77 56.53,30.5 v56.53,12.72
  Bottom 0.254: AH.G0 81.3,21.61 68.28,7.96 v56.53,7.96 26.37,7.96 12.72,21.61 BL.G7
D9/A1  (via drill 0.38)
  Top 0.203: U4.37 50.39,28.91 51.24,28.91 U3.37 53.46,31.13 v54.63,31.13 | v55.9,11.77 v55.9,7.01
  Bottom 0.203: v55.9,11.77 55.9,30.18 54.95,31.13 v54.63,31.13
  Bottom 0.254: AH.G1 81.3,19.07 69.23,7.01 v55.9,7.01 24.79,7.01 12.72,19.07 BL.G6
D10/A0  (via drill 0.38)
  Top 0.203: U4.36 50.62,28.44 51.9,28.44 U3.36 53.68,30.22 v53.68,30.5 | v55.27,12.72 v55.27,6.05
  Bottom 0.203: v53.68,30.5 54.63,30.5 55.27,29.86 v55.27,12.72
  Bottom 0.254: AH.G2 81.3,16.53 70.82,6.05 v55.27,6.05 23.2,6.05 12.72,16.53 BL.G5
D11*  (via drill 0.38)
  Top 0.203: U4.32 50.85,25.42 52.55,25.42 U3.32 | v54.63,11.77 v54.63,5.1
  Top 0.254: U3.32 54.63,23.34 v54.63,18.43
  Bottom 0.203: 54.63,17.16 v54.63,11.77
  Bottom 0.254: AH.G3 81.3,13.99 72.41,5.1 v54.63,5.1 21.61,5.1 12.72,13.99 BL.G4 | v54.63,18.43 54.63,17.16
D12*  (via drill 0.38)
  Top 0.203: U4.31 50.62,24.94 51.9,24.94 U3.31 | v53.99,12.72 v53.99,4.15
  Top 0.254: U3.31 53.99,22.84 v53.99,19.39
  Bottom 0.203: 53.99,16.53 v53.99,12.72
  Bottom 0.254: AH.G4 81.3,11.45 74,4.15 v53.99,4.15 20.02,4.15 12.72,11.45 BL.G3 | v53.99,19.39 53.99,16.53
D13*  (via drill 0.38)
  Top 0.203: U3.30 51.24,24.47 50.39,24.47 U4.30 | v53.36,11.77 v53.36,3.2
  Top 0.254: U3.30 53.36,22.35 v53.36,18.43
  Bottom 0.203: 53.36,16.53 v53.36,11.77
  Bottom 0.254: AH.G5 81.3,8.91 75.58,3.2 v53.36,3.2 18.43,3.2 12.72,8.91 BL.G2 | v53.36,18.43 53.36,16.53
D14  (via drill 0.38)
  Top 0.203: U4.1 45.9,31.08 45.9,33.2 U3.1 44.79,34.31 44.79,34.63 45.1,34.95 45.74,34.95 v46.06,34.63 | v45.1,11.77 v45.1,2.24
  Bottom 0.203: v46.06,34.63 45.1,33.67 v45.1,11.77
  Bottom 0.254: AH.G6 81.3,6.37 77.17,2.24 v45.1,2.24 16.85,2.24 12.72,6.37 BL.G1
D15  (via drill 0.38)
  Top 0.203: U4.28 U3.28 | v52.09,11.77 v52.09,1.29
  Top 0.254: U3.28 52.09,21.36 v52.09,18.43
  Bottom 0.203: 52.09,16.53 v52.09,11.77
  Bottom 0.254: BL.G0 12.72,3.83 15.26,1.29 v52.09,1.29 78.76,1.29 81.3,3.83 AH.G7 | v52.09,18.43 52.09,16.53
D+
  Top 0.203: USB.D+ 22.75,43.33 24.15,41.93 31.77,41.93 36.85,36.85 R4.1
D-
  Top 0.203: USB.D- 23.55,43.8 24.79,42.56 32.41,42.56 36.85,38.12 45.1,38.12 45.47,37.76 R7.1
EN  (via drill 0.6)
  Top 0.61: U2.3 71.46,35.26 70.5,36.22 v69.23,36.22 | v65.42,36.22 68.6,39.39 68.6,44.47 70.76,46.63 PSW1.2
  Bottom 0.61: v69.23,36.22 v65.42,36.22
GND
  Top 0.203: U4.23 47.49,22.42 47.49,20.3 U3.23 48.6,19.19 48.6,18.43 49.23,17.8 51.77,17.8 53.04,16.53 R8.1 | U3.15 42.27,24.47 43.12,24.47 U4.15 45.34,26.69 | U3.35 52.55,27.96 50.85,27.96 U4.35 49.58,26.69 U3.P$1
  Top 0.61: 70.5,27.96 C4.1
  Top 0.813: U3.P$1 45.34,26.69
  pour Top: -1.25,8.37 -1.25,47.03 6.37,47.03 6.37,55.27 85.95,55.27 85.95,45.01 96.19,45.01 96.19,8.37 85.95,8.37 85.95,-1.25 7.64,-1.25 7.64,8.37
HWB
  Top 0.203: U3.33 53.21,25.9 51.09,25.9 U4.33
  Top 0.254: U3.33 55.43,23.67 R8.2
I2C-SCL  (via drill 0.38)
  Top 0.203: U4.18 44.15,23.38 44.15,22.95 U3.18 41.3,20.1 41.3,16.53 42.56,15.26 | 48.28,15.26 49.87,15.26 50.35,15.74 R12.1 | 48.28,15.26 42.56,15.26 | v21.61,14.62 12.72,14.62 12.09,15.26 8.91,15.26 BL.I2C-SCL@B5 5.1,19.07 5.1,45.1 v4.46,45.74 | v35.58,14.62 41.93,14.62 42.56,15.26 | AH.I2C-SCL@B5 85.75,8.91 84.47,10.18 61.62,10.18 57.8,13.99 48.91,13.99 48.28,14.62 48.28,15.26 | AL.I2C-SCL@B5 85.87,36.72 88.28,34.31 88.28,8.28 v88.92,7.64
  Bottom 0.203: BH.I2C-SCL@B5 5.74,44.47 v4.46,45.74 | v88.92,7.64 87.14,7.64 AH.I2C-SCL@B5 | v21.61,14.62 v35.58,14.62
I2C-SDA  (via drill 0.38)
  Top 0.203: U4.19 44.63,23.15 44.63,22.3 U3.19 41.93,19.6 41.93,18.75 | 41.93,18.75 41.93,17.16 42.56,16.53 R11.1 | v22.88,13.99 12.72,13.99 11.45,12.72 8.91,12.72 BL.I2C-SDA@B4 4.46,17.16 4.46,43.84 v3.83,44.47 | v36.85,13.99 v42.56,13.99 43.2,13.99 43.84,13.36 57.17,13.36 61.62,8.91 v77.49,8.91 | v42.56,18.75 41.93,18.75 | AL.I2C-SDA@B4 88.92,36.34 88.92,9.54 v89.56,8.91
  Bottom 0.203: v42.56,13.99 v42.56,18.75 | v77.49,8.91 81.3,12.72 84.6,12.72 AH.I2C-SDA@B4 88.41,8.91 v89.56,8.91 | BH.I2C-SDA@B4 6.37,41.93 v3.83,44.47 | v36.85,13.99 v22.88,13.99
N$1
  Top 0.61: R1.1 68.6,25.42 67.33,24.15 CHG.C
N$2
  Top 0.203: R3.2 61.62,31.77 62.25,31.13 62.25,29.23 | R2.2 62.25,29.23 | 62.25,29.23 62.25,24.79 61.62,24.15 R5.1
N$3
  Top 0.61: U1.1 73.36,25.32 R1.2
N$4
  Top 0.61: U1.5 73.36,18.44 74.31,17.48 76.22,17.48 77.49,18.75 R6.1
RD+
  Top 0.203: U4.4 44.47,30.39 44.47,31.24 U3.4 41.3,34.41 41.3,36.22 40.66,36.85
  Top 0.254: R4.2 40.66,36.85
RD-
  Top 0.203: U4.3 44.95,30.62 44.95,31.89 U3.3 42.56,34.27 42.56,36.22 43.2,36.85
  Top 0.254: R7.2 43.2,36.85
RESET  (via drill 0.38)
  Top 0.203: U4.13 42.66,25.42 40.96,25.42 U3.13 39.69,24.15 34.95,24.15 v34.31,24.79 33.84,25.25 R10.1 33.84,27.49 34.74,28.39 D2.A | v5.1,47.01 5.74,46.38 5.74,20.98 BL.RESET@B6 8.91,20.34 v19.7,20.34 25.42,14.62 v25.42,12.72 | v88.28,6.37 87.65,7.01 87.65,32.53 AL.RESET@B6
  Bottom 0.203: v19.7,20.34 24.15,24.79 v34.31,24.79 | BH.RESET@B6 v5.1,47.01 | AH.RESET@B6 v88.28,6.37 | AL.RESET@B6 84.6,33.04 84.6,28.09 83.84,27.32 79.39,27.32 77.49,25.42 77.49,22.88 65.74,11.13 27.01,11.13 v25.42,12.72
SPI-CS1  (via drill 0.38)
  Top 0.203: U4.25 48.44,22.89 48.44,21.61 U3.25 50.19,19.87 v50.19,19.39 | BH.SPI-CS@B3 8.91,38.12 10.81,38.12 11.45,37.48 11.45,36.22 v13.99,33.67
  Bottom 0.203: v13.99,33.67 19.7,39.39 33.67,39.39 34.95,40.66 49.55,40.66 50.19,40.02 v50.19,19.39
SPI-CS2  (via drill 0.38)
  Top 0.203: U4.26 48.91,23.12 48.91,22.27 U3.26 50.82,20.36 v50.82,18.43 | BL.SPI-CS@B3 8.91,10.18 10.81,10.18 13.99,13.36 v24.15,13.36 | v38.12,13.36 41.93,13.36 42.56,12.72 v50.82,12.72
  Bottom 0.203: v50.82,12.72 v50.82,18.43 | v24.15,13.36 v38.12,13.36
SPI-CS3  (via drill 0.38)
  Top 0.203: U4.8 43.12,28.91 42.27,28.91 U3.8 39.1,32.09 v38.76,32.09 | AL.SPI-CS@B3 84.6,40.66 73.68,40.66 v73.36,40.34 | v38.12,39.39 38.12,49.55 38.76,50.19 57.17,50.19 57.8,49.55 v57.8,40.02
  Bottom 0.203: v38.76,32.09 38.12,32.72 v38.12,39.39 | v57.8,40.02 58.12,40.34 v73.36,40.34
SPI-CS4  (via drill 0.38)
  Top 0.203: U4.22 46.06,22.46 46.06,20.34 U3.22 44.47,18.75 44.47,17.8 44.79,17.48 46.06,17.48 v47.01,18.43 | AH.SPI-CS@B3 84.6,12.72 60.34,12.72 58.44,14.62 v49.55,14.62
  Bottom 0.203: v49.55,14.62 48.91,14.62 48.28,15.26 48.28,17.16 v47.01,18.43
SPI-MISO  (via drill 0.38)
  Top 0.203: U4.11 42.43,27.48 40.3,27.48 U3.11 38.56,29.23 v36.85,29.23 | BL.SPI-MISO@B0 5.1,6.37 5.1,8.91 2.56,11.45 2.56,40.02 v1.92,40.66 | BH.SPI-MISO@B0 8.91,30.5 13.36,30.5 v13.99,29.86 | AL.SPI-MISO@B0 88.92,46.5 88.92,41.3 90.83,39.39 90.83,13.36 v91.46,12.72 | AH.SPI-MISO@B0 84.6,22.88 v81.3,22.88 | v28.59,8.91 28.59,28.59 v27.32,29.86
  Bottom 0.203: v1.92,40.66 3.2,39.39 3.2,36.22 BH.SPI-MISO@B0 | v13.99,29.86 v27.32,29.86 36.22,29.86 v36.85,29.23 | v91.46,12.72 88.92,15.26 88.92,18.56 AH.SPI-MISO@B0 | v81.3,22.88 67.33,8.91 v28.59,8.91
SPI-MOSI  (via drill 0.38)
  Top 0.203: U4.10 42.66,27.96 40.96,27.96 U3.10 38.74,30.18 v37.48,30.18 | v2.56,41.93 3.2,41.3 3.2,12.09 5.74,9.54 5.74,8.28 BL.SPI-MOSI@B1 | BH.SPI-MOSI@B1 8.91,33.04 12.09,33.04 v13.99,31.13 | v90.83,11.45 90.19,12.09 90.19,38.76 88.28,40.66 88.28,44.6 AL.SPI-MOSI@B1 | AH.SPI-MOSI@B1 84.6,20.34 81.3,20.34 80.03,21.61 v80.03,22.88 | v29.23,9.54 29.23,30.5 v28.59,31.13
  Bottom 0.203: BH.SPI-MOSI@B1 4.46,37.48 4.46,40.02 v2.56,41.93 | v13.99,31.13 v28.59,31.13 29.23,30.5 37.17,30.5 v37.48,30.18 | AH.SPI-MOSI@B1 88.28,16.66 88.28,12.72 89.56,11.45 v90.83,11.45 | v80.03,22.88 66.69,9.54 v29.23,9.54
SPI-SCK  (via drill 0.38)
  Top 0.203: U4.9 42.89,28.44 41.62,28.44 U3.9 38.92,31.13 v38.12,31.13 | v3.2,43.2 3.83,42.56 3.83,12.72 BL.SPI-SCK@B2 | BH.SPI-SCK@B2 8.91,35.58 10.81,35.58 v13.99,32.41 | v90.19,10.18 89.56,10.81 89.56,38.12 87.65,40.02 87.65,42.69 AL.SPI-SCK@B2 | AH.SPI-SCK@B2 84.6,17.8 81.94,17.8 78.76,20.98 v78.76,22.88 | v29.86,10.18 v29.86,32.41
  Bottom 0.203: BH.SPI-SCK@B2 5.74,38.76 5.74,40.66 v3.2,43.2 | v13.99,32.41 v29.86,32.41 31.13,31.13 v38.12,31.13 | AH.SPI-SCK@B2 87.65,14.75 87.65,11.45 88.92,10.18 v90.19,10.18 | v78.76,22.88 66.06,10.18 v29.86,10.18
UCAP
  Top 0.203: U4.6 U3.6 39.77,33.67 35.58,33.67 34.95,33.04 32.41,33.04 32.24,33.2 C11.1
UGND
  Top 0.203: U4.5 43.99,30.16 43.99,30.58 U3.5 40.27,34.31 35.58,34.31 | C11.2 35.58,34.31 | R101.2 34.95,36.85 35.58,36.22 35.58,34.31
VBAT  (via drill 0.6)
  Top 0.203: R5.2 58.91,23.05 59.71,22.25 63.52,22.25
  Top 0.61: U1.3 71.46,22.56 70.5,23.52 69.87,23.52 69.23,22.88 69.23,15.26 | D1.A 67.33,29.23 66.06,27.96 | 66.06,27.96 63.52,25.42 63.52,22.25 63.52,17.8 66.06,15.26 69.23,15.26 | C2.1 69.23,15.26 | X100.2 13.72,35.85 12.72,36.85 12.72,48.91 v13.99,50.19 | v63.52,50.19 63.52,30.5 66.06,27.96
  Bottom 0.61: v13.99,50.19 v63.52,50.19
VBUS  (via drill 0.38, 0.6)
  Top 0.203: U4.7 43.35,29.39 42.93,29.39 U3.7 40.02,32.29 40.02,32.41 v39.39,33.04 | BL.5V@B7 6.37,22.88 6.37,48.28 BH.5V@B7 | v39.39,39.39 v39.39,48.91 | 73.04,35.58 73.68,36.22 78.76,36.22 79.39,35.58 83.84,35.58 84.6,34.82 84.6,33.04 AL.5V@B7 85.87,31.64 87.02,30.5 87.02,4.97 AH.5V@B7
  Top 0.406: USB.VUSB 24.35,44.27 25.42,43.2 29.23,43.2 30.5,44.47 v30.5,48.91 | v72.73,48.91 72.76,48.28
  Top 0.61: 69.87,38.12 69.23,38.12 67.33,36.22 D1.C 68.66,34.89 69.23,34.31 69.23,28.59 65.42,24.79 65.42,18.43 66.06,17.8 v67.33,17.8 CHG.A | U2.1 73.36,35.26 73.04,35.58 71.78,36.84 71.78,36.85 71.46,37.16 C1.1 69.87,38.12 | PSW1.1 72.76,48.28 72.76,47.01 69.87,44.12 69.87,38.12 | v71.14,17.8 71.46,18.11 U1.4
  Bottom 0.203: v39.39,33.04 v39.39,39.39 | BH.5V@B7 8.91,50.82 12.09,50.82 17.8,45.1 26.69,45.1 v30.5,48.91
  Bottom 0.61: v71.14,17.8 v67.33,17.8 | v72.73,48.91 v39.39,48.91 v30.5,48.91
XTAL1
  Top 0.203: U4.17 U3.17 40.66,20.59 40.66,17.8 40.41,17.55 R9.1 | C7.1 36.85,16.53 38.76,16.53 39.39,17.16
  Top 0.254: 39.39,17.16 R9.1 | X1.1 36.85,16.53
XTAL2
  Top 0.203: U4.16 43.35,23.99 42.93,23.99 U3.16 39.39,20.45 39.39,20.34 | C6.2 36.85,20.34 39.39,20.34 | R9.2 39.39,20.34
  Top 0.254: X1.2 36.85,20.34

### Text on the board
Dimension: <---Cutout
bPlace: Gadget Box / Copyright 2016 / Gadget Factory, LLC / Version 1.8 | To get started visit: / GadgetBox.GadgetFactory.net
bNames: Off | On